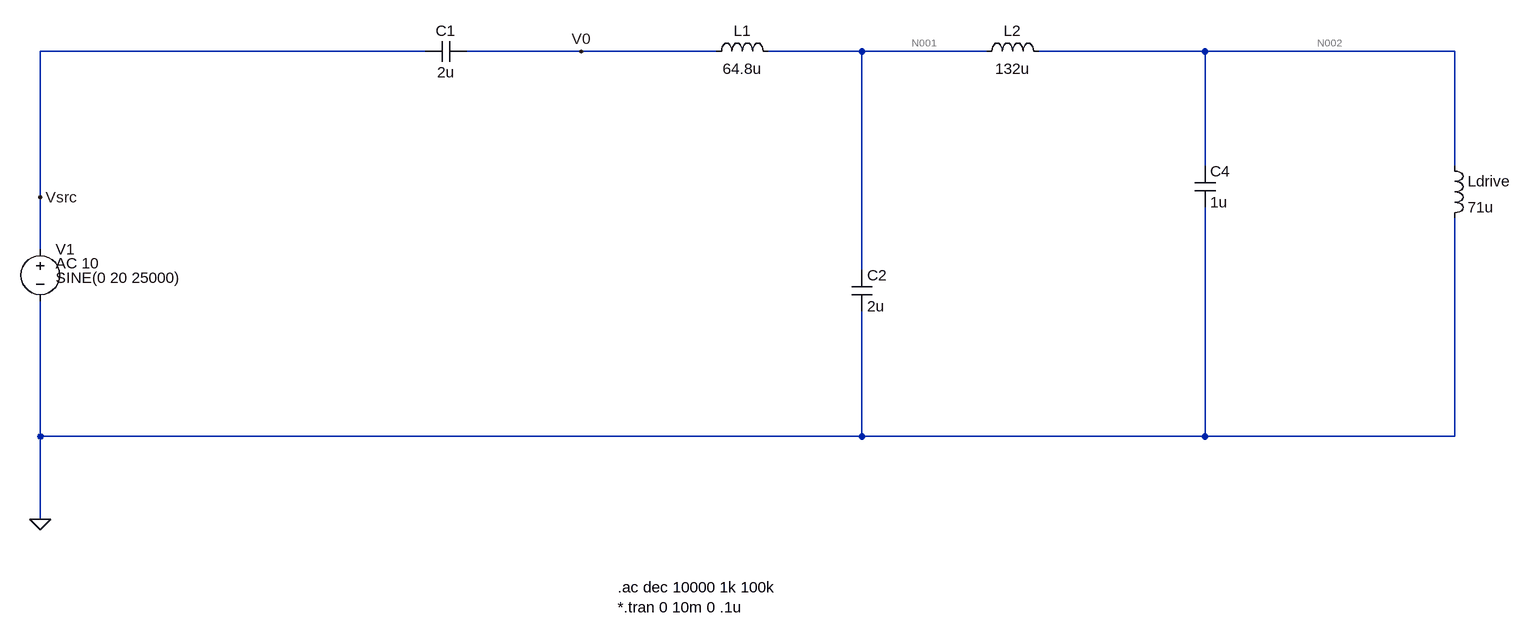
[diagram p0: schematic TestCirc1_2Src.asc]
TestCirc1_2Src.asc, the LTspice schematic file:
Version 4
SHEET 1 2128 1188
WIRE 416 64 -176 64
WIRE 656 64 480 64
WIRE 864 64 656 64
WIRE 1088 64 944 64
WIRE 1280 64 1088 64
WIRE 1616 64 1360 64
WIRE 2000 64 1616 64
WIRE 1616 240 1616 64
WIRE 2000 240 2000 64
WIRE -176 288 -176 64
WIRE -176 368 -176 288
WIRE 1088 400 1088 64
WIRE -176 656 -176 448
WIRE 1088 656 1088 464
WIRE 1088 656 -176 656
WIRE 1616 656 1616 304
WIRE 1616 656 1088 656
WIRE 2000 656 2000 320
WIRE 2000 656 1616 656
WIRE -176 784 -176 656
FLAG -176 288 Vsrc
FLAG 656 64 V0
FLAG -176 784 0
SYMBOL voltage -176 352 R0
WINDOW 123 24 38 Left 2
WINDOW 3 24 60 Left 2
WINDOW 39 0 0 Left 0
SYMATTR Value2 AC 10
SYMATTR Value SINE(0 20 25000)
SYMATTR InstName V1
SYMBOL ind 1984 224 R0
SYMATTR InstName Ldrive
SYMATTR Value 71u
SYMATTR SpiceLine Rser=200m
SYMBOL ind 848 80 R270
WINDOW 0 32 56 VTop 2
WINDOW 3 5 56 VBottom 2
SYMATTR InstName L1
SYMATTR Value 64.8u
SYMATTR SpiceLine Rser=100m
SYMBOL ind 1264 80 R270
WINDOW 0 32 56 VTop 2
WINDOW 3 5 56 VBottom 2
SYMATTR InstName L2
SYMATTR Value 132u
SYMATTR SpiceLine Rser=100m
SYMBOL cap 480 48 R90
WINDOW 0 0 32 VBottom 2
WINDOW 3 32 32 VTop 2
SYMATTR InstName C1
SYMATTR Value 2u
SYMATTR SpiceLine Rser=10m
SYMBOL cap 1072 400 R0
SYMATTR InstName C2
SYMATTR Value 2u
SYMATTR SpiceLine Rser=10m
SYMBOL cap 1600 240 R0
SYMATTR InstName C4
SYMATTR Value 1u
SYMATTR SpiceLine Rser=10m
TEXT 712 888 Left 2 !.ac dec 10000 1k 100k\n*.tran 0 10m 0 .1u

The netlist it stands for:
* TestCirc1_2Src.asc
V1 Vsrc 0 SINE(0 20 25000) AC 10
Ldrive N002 0 71u Rser=200m
L1 V0 N001 64.8u Rser=100m
L2 N001 N002 132u Rser=100m
C1 V0 Vsrc 2u Rser=10m
C2 N001 0 2u Rser=10m
C4 N002 0 1u Rser=10m
.ac dec 10000 1k 100k
*.tran 0 10m 0 .1u
.backanno
.end

* Results of the author's LTspice run, read from the files saved beside the schematic
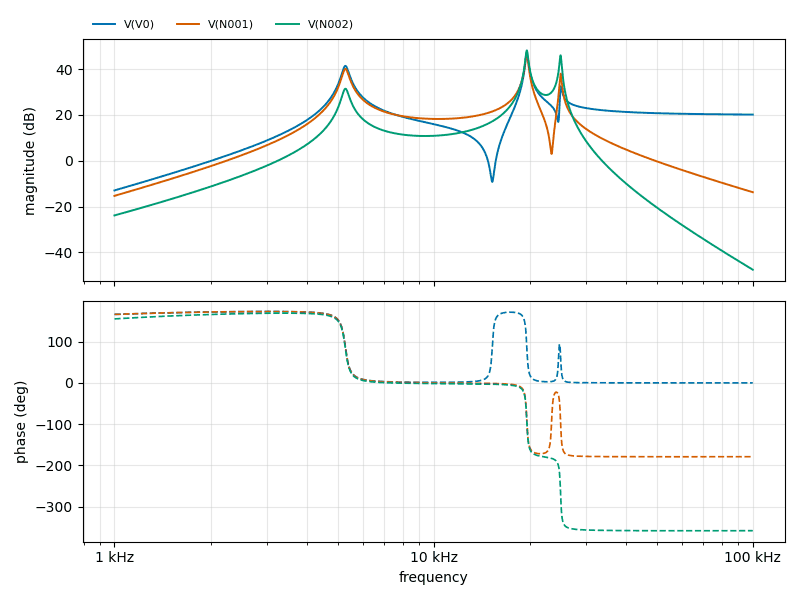
[diagram p1: AC Analysis of TestCirc1_2Src.asc, plotted from the saved traces]
* AC Analysis, 1 run:
*   V(V0): -12.96 dB at 1 kHz, 20.17 dB at 100 kHz, peak 47.26 dB at 19.58 kHz, 3 dB below the peak at 19.42 kHz and 19.76 kHz
*   V(N001): -15.33 dB at 1 kHz, -13.75 dB at 100 kHz, peak 46.91 dB at 19.57 kHz, 3 dB below the peak at 19.41 kHz and 19.74 kHz
*   V(N002): -23.88 dB at 1 kHz, -47.59 dB at 100 kHz, peak 48.20 dB at 19.58 kHz, 3 dB below the peak at 19.42 kHz and 19.75 kHz